# Altium schematic sheet CarteAction_PontLevis2026.SchDoc
size A4; SheetNumber: 2; SheetTotal: 2
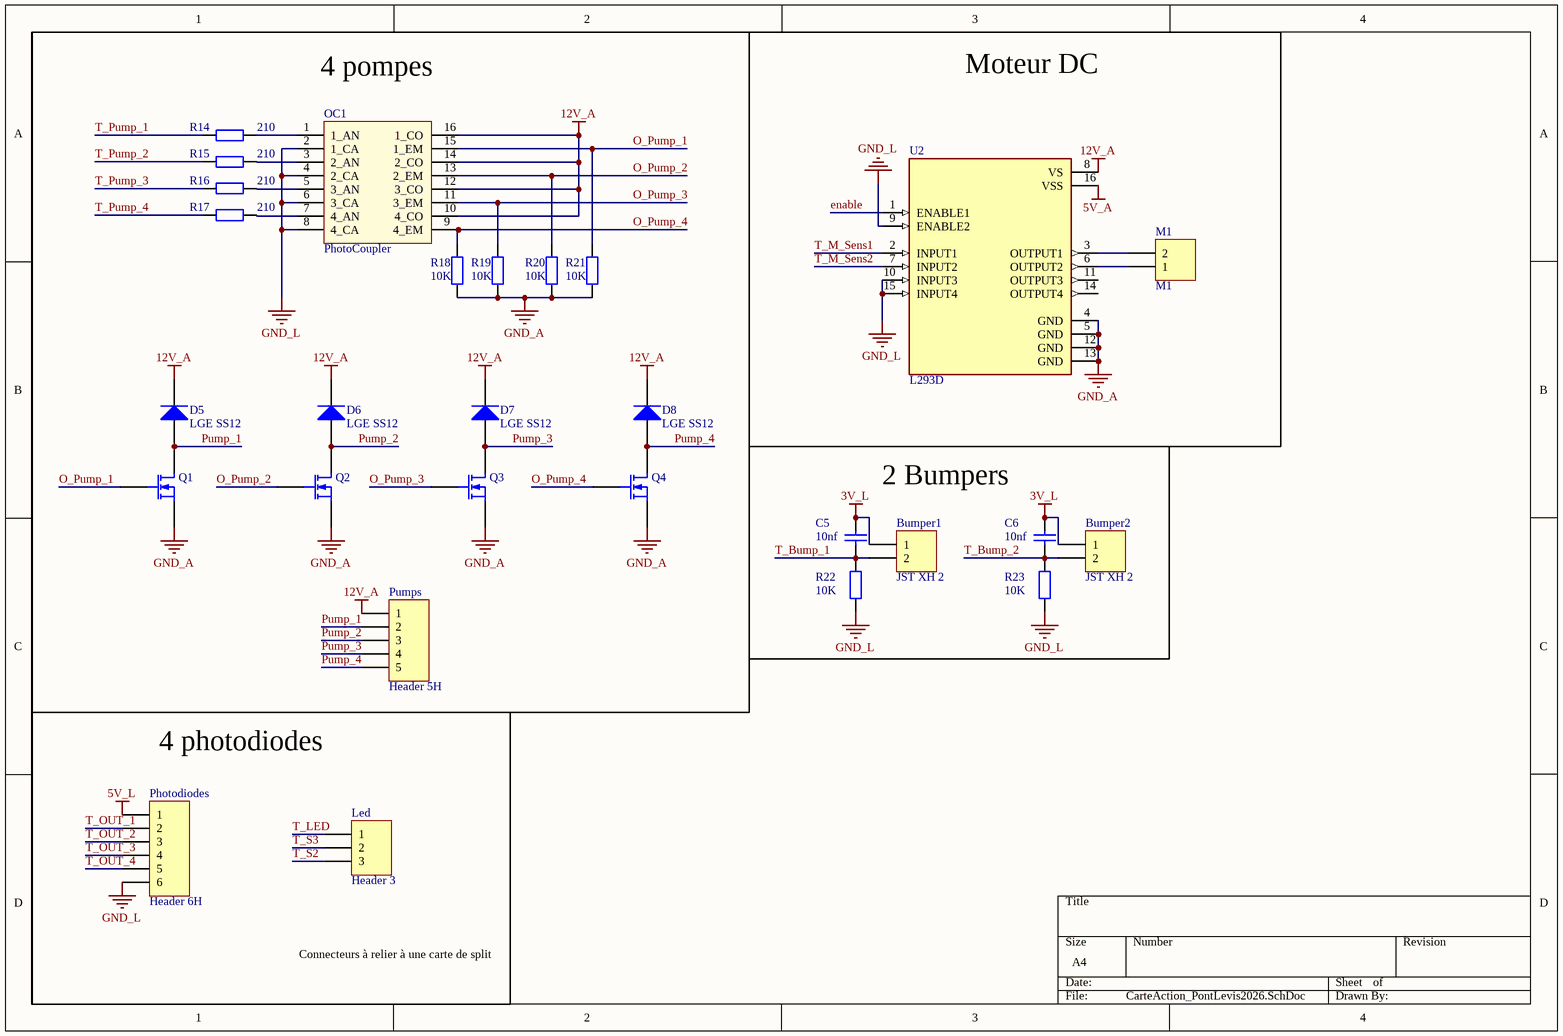
[diagram p0: CarteAction_PontLevis2026.SchDoc]

## Parts
Bumper1  JST XH 2  [S2B-XH-A]
Bumper2  JST XH 2  [S2B-XH-A]
C5  value 10nf  [Capacitor 1206]  (hidden comment: Cap)
C6  value 10nf  [Capacitor 1206]  (hidden comment: Cap)
D5  LGE SS12  [SMB]
D6  LGE SS12  [SMB]
D7  LGE SS12  [SMB]
D8  LGE SS12  [SMB]
Led  Header 3  [S3B-XH-A]
M1  M1  [S2B-XH-A]
OC1  PhotoCoupler  [16 pins SOIC, TI]
Photodiodes  Header 6H  [S6B-XH-A]
Pumps  Header 5H  [S5B-XH-A]
Q1  MOSFET-N  [SOT23_M]  (value not drawn)
Q2  MOSFET-N  [SOT23_M]  (value not drawn)
Q3  MOSFET-N  [SOT23_M]  (value not drawn)
Q4  MOSFET-N  [SOT23_M]  (value not drawn)
R14  value 210  [Resistor 1206]  (hidden comment: Res2)
R15  value 210  [Resistor 1206]  (hidden comment: Res2)
R16  value 210  [Resistor 1206]  (hidden comment: Res2)
R17  value 210  [Resistor 1206]  (hidden comment: Res2)
R18  value 10K  [Resistor 1206]  (hidden comment: Res2)
R19  value 10K  [Resistor 1206]  (hidden comment: Res2)
R20  value 10K  [Resistor 1206]  (hidden comment: Res2)
R21  value 10K  [Resistor 1206]  (hidden comment: Res2)
R22  value 10K  [Resistor 1206]  (hidden comment: Res2)
R23  value 10K  [Resistor 1206]  (hidden comment: Res2)
U2  L293D  [DIP880W50P254L2000H510Q16]

## Nets
3V_L: Bumper1.1 Bumper2.1 C5.2 C6.2
5V_A: U2.16(VSS)
5V_L: Photodiodes.1
12V_A: D5.2(K) D6.2(K) D7.2(K) D8.2(K) OC1.10(4_CO) OC1.12(3_CO) OC1.14(2_CO) OC1.16(1_CO) Pumps.1 U2.8(VS)
GND_A: Q1.3(S) Q2.3(S) Q3.3(S) Q4.3(S) R18.1 R19.1 R20.1 R21.1 U2.4(GND) U2.5(GND) U2.12(GND) U2.13(GND)
GND_L: OC1.2(1_CA) OC1.4(2_CA) OC1.6(3_CA) OC1.8(4_CA) Photodiodes.6 R22.2 R23.2 U2.9(ENABLE2) U2.10(INPUT3) U2.15(INPUT4)
enable: U2.1(ENABLE1)
O_Pump_1: OC1.15(1_EM) Q1.2(G) R21.2
O_Pump_2: OC1.13(2_EM) Q2.2(G) R20.2
O_Pump_3: OC1.11(3_EM) Q3.2(G) R19.2
O_Pump_4: OC1.9(4_EM) Q4.2(G) R18.2
Pump_1: D5.1(A) Pumps.2 Q1.1(D)
Pump_2: D6.1(A) Pumps.3 Q2.1(D)
Pump_3: D7.1(A) Pumps.4 Q3.1(D)
Pump_4: D8.1(A) Pumps.5 Q4.1(D)
T_Bump_1: Bumper1.2 C5.1 R22.1
T_Bump_2: Bumper2.2 C6.1 R23.1
T_LED: Led.1
T_M_Sens1: U2.2(INPUT1)
T_M_Sens2: U2.7(INPUT2)
T_OUT_1: Photodiodes.2
T_OUT_2: Photodiodes.3
T_OUT_3: Photodiodes.4
T_OUT_4: Photodiodes.5
T_Pump_1: R14.2
T_Pump_2: R15.2
T_Pump_3: R16.2
T_Pump_4: R17.2
T_S2: Led.3
T_S3: Led.2
NetM1_1: M1.1 U2.6(OUTPUT2)
NetM1_2: M1.2 U2.3(OUTPUT1)
NetOC1_1: OC1.1(1_AN) R14.1
NetOC1_3: OC1.3(2_AN) R15.1
NetOC1_5: OC1.5(3_AN) R16.1
NetOC1_7: OC1.7(4_AN) R17.1

Not connected (* = marked no-connect by the designer): U2 11(OUTPUT3) 14(OUTPUT4)

## Notes on the sheet
- (near OC1) 4 pompes
- Moteur DC
- 2 Bumpers
- 4 photodiodes
- Connecteurs à relier à une carte de split

## Library data of the parts
Bumper1 Bumper2 = Header 2: Header, 2-Pin; LatestRevisionDate: 17-Jul-2002; LatestRevisionNote: Re-released for DXP Platform.; Publisher: Altium Limited
C5 C6 = Cap: Capacitor; Published: 8-Jun-2000; LatestRevisionDate: 17-Jul-2002; LatestRevisionNote: Re-released for DXP Platform.; PackageReference: RAD-0.3; Publisher: Altium Limited; PackageDescription: Radial Cap, Thru-Hole; 2 Leads; 0.3 in Pin Spacing
D5-D8 = Diode: Default Diode; Published: 8-Jun-2000; LatestRevisionDate: 17-Jul-2002; LatestRevisionNote: Re-released for DXP Platform.; PackageVersion: Sep-1996; PackageReference: SMC; Publisher: Altium Limited; PackageDescription: DO-214-AB/SMC; 2 C-Bend Leads; Body 7.9 x 5.9 mm, inc. leads (LxW); Code_JEDEC: DO-214-AB
Led = Header 3: Header, 3-Pin; LatestRevisionDate: 17-Jul-2002; LatestRevisionNote: Re-released for DXP Platform.; Publisher: Altium Limited
M1 = Header 2H: Header, 2-Pin, Right Angle; LatestRevisionDate: 17-Jul-2002; LatestRevisionNote: Re-released for DXP Platform.; Publisher: Altium Limited
OC1 = LTV-247: Integrated Circuit; Manufacturer_Name: Lite-On; Datasheet Link: http://optoelectronics.liteon.com/upload/download/DS70-2009-0014/LTV-2X7%20sereis%20Mar17.PDF; Manufacturer_Part_Number: LTV-247; Mouser Part Number: 859-LTV-247; Mouser Price/Stock: https://www.mouser.co.uk/ProductDetail/Lite-On/LTV-247/?qs=9ayhpukWNmvWpoxQBzWkFA%3D%3D; Arrow Part Number: LTV-247; Arrow Price/Stock: https://www.arrow.com/en/products/ltv-247/lite-on-technology
Photodiodes = Header 6H: Header, 6-Pin, Right Angle; LatestRevisionDate: 17-Jul-2002; LatestRevisionNote: Re-released for DXP Platform.; Publisher: Altium Limited
Pumps = Header 5H: Header, 5-Pin, Right Angle; LatestRevisionDate: 17-Jul-2002; LatestRevisionNote: Re-released for DXP Platform.; Publisher: Altium Limited
Q1-Q4 = MOSFET-N: N-Channel MOSFET; pin to pad: 2>3 3>2; Published: 8-Jun-2000; LatestRevisionDate: 17-Jul-2002; LatestRevisionNote: Re-released for DXP Platform.; PackageVersion: 1995/1996; PackageReference: E3; Publisher: Altium Limited; PackageDescription: TO, Flat Index; 3 In-Line, Axial Leads; Body Dia. 4.6mm; Lead Dia. 0.5 mm (max)
R14-R23 = Res2: Resistor; Published: 8-Jun-2000; LatestRevisionDate: 17-Jul-2002; LatestRevisionNote: Re-released for DXP Platform.; PackageReference: AXIAL-0.4; Publisher: Altium Limited; PackageDescription: Axial Device, Thru-Hole; 2 Leads; 0.4 in Pin Spacing
U2 = L293D: Bipolar Motor Driver - Parallel 16-PowerDIP; MF: STMicroelectronics; MP: L293D; Package: DIP-16 STMicroelectronics; SnapEDA_Link: https://www.snapeda.com/parts/L293D/STMicroelectronics/view-part/?ref=snap; Purchase-URL: https://pricing.snapeda.com/search/part/L293D/?ref=eda; Check_prices: https://www.snapeda.com/parts/L293D/STMicroelectronics/view-part/?ref=eda; Availability: In Stock; Value: *; Price: None